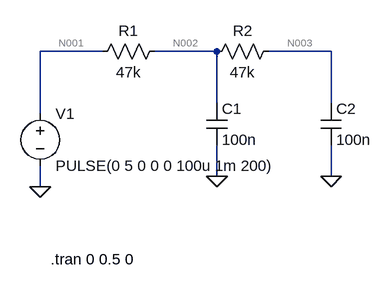
[diagram p0: schematic PWM_Filter.asc]
PWM_Filter.asc, the LTspice schematic file:
Version 4
SHEET 1 880 680
WIRE 208 48 112 48
WIRE 384 48 288 48
WIRE 560 48 464 48
WIRE 384 128 384 48
WIRE 560 128 560 48
WIRE 112 144 112 48
WIRE 384 240 384 192
WIRE 560 240 560 192
WIRE 112 256 112 224
FLAG 112 256 0
FLAG 384 240 0
FLAG 560 240 0
SYMBOL voltage 112 128 R0
WINDOW 123 0 0 Left 2
WINDOW 39 0 0 Left 2
SYMATTR InstName V1
SYMATTR Value PULSE(0 5 0 0 0 100u 1m 200)
SYMBOL cap 368 128 R0
SYMATTR InstName C1
SYMATTR Value 100n
SYMBOL res 304 32 R90
WINDOW 0 0 56 VBottom 2
WINDOW 3 32 56 VTop 2
SYMATTR InstName R1
SYMATTR Value 47k
SYMBOL cap 544 128 R0
SYMATTR InstName C2
SYMATTR Value 100n
SYMBOL res 480 32 R90
WINDOW 0 0 56 VBottom 2
WINDOW 3 32 56 VTop 2
SYMATTR InstName R2
SYMATTR Value 47k
TEXT 128 368 Left 2 !.tran 0 0.5 0

The netlist it stands for:
* PWM_Filter.asc
V1 N001 0 PULSE(0 5 0 0 0 100u 1m 200)
C1 N002 0 100n
R1 N002 N001 47k
C2 N003 0 100n
R2 N003 N002 47k
.tran 0 0.5 0
.backanno
.end

* Results of the author's LTspice run, read from the files saved beside the schematic
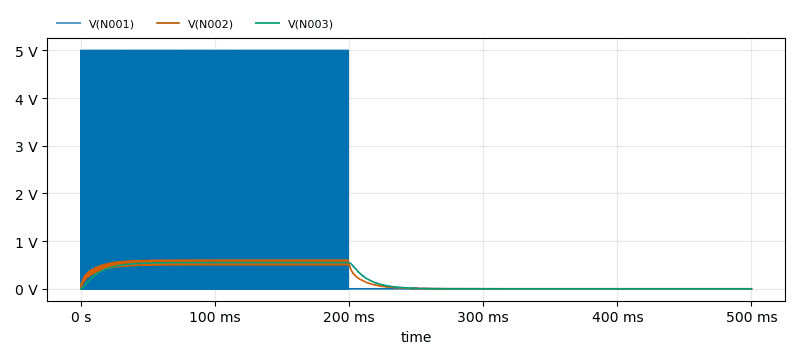
[diagram p1: Transient Analysis of PWM_Filter.asc, plotted from the saved traces]
* Transient Analysis, 1 run:
*   V(N001): min 0 V, max 5 V, average 220 mV, rms 1.035 V, last 0 V
*   V(N002): min 0 V, max 604 mV, average 220.1 mV, rms 338.8 mV, last 0 V
*   V(N003): min 0 V, max 550.9 mV, average 219.9 mV, rms 336.7 mV, last 0 V